# Altium schematic sheet Protect.SchDoc
size A; SheetNumber: 7; SheetTotal: 8
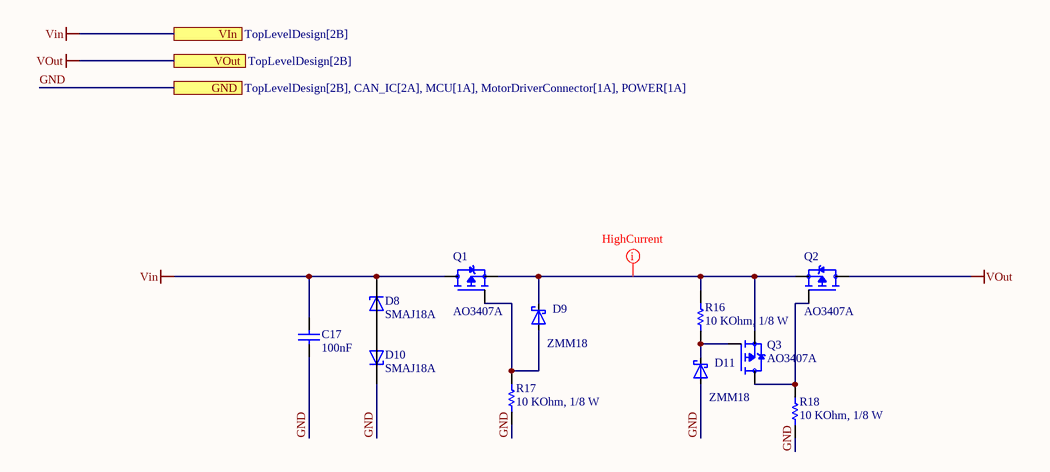
[diagram p0: Protect.SchDoc]

## Parts
C17  value 100nF  [CAP_0805]  (hidden comment: 0108051041050)
D8  SMAJ18A  [DIOM4325X250N]
D9  ZMM18  [SOD-80_MiniMELF_Glass]
D10  SMAJ18A  [DIOM4325X250N]
D11  ZMM18  [SOD-80_MiniMELF_Glass]
Q1  AO3407A  [SOT95P280X125-3N]
Q2  AO3407A  [SOT95P280X125-3N]
Q3  AO3407A  [SOT95P280X125-3N]
R16  value 10 KOhm, 1/8 W  [RESISTOR_0805]  (hidden comment: 0008051031)
R17  value 10 KOhm, 1/8 W  [RESISTOR_0805]  (hidden comment: 0008051031)
R18  value 10 KOhm, 1/8 W  [RESISTOR_0805]  (hidden comment: 0008051031)

## Ports
GND (see TopLevelDesign[2B], CAN_IC[2A], MCU[1A], MotorDriverConnector[1A], POWER[1A]), VIn (see TopLevelDesign[2B]), VOut (see TopLevelDesign[2B])

## Nets
Vin: C17.2 D8.C Q1.3(D) ; port VIn
VOut: Q2.3(D) ; port VOut
GND: C17.1 D10.C D11.A R17.1 R18.1 ; port GND
NetD8_A: D8.A D10.A
NetD9_A: D9.A Q1.1(G) R17.2
NetD9_K: D9.K Q1.2(S) Q2.2(S) Q3.2(S) R16.2
NetD11_K: D11.K Q3.1(G) R16.1
NetQ2_1: Q2.1(G) Q3.3(D) R18.2

## Layout directives
rule Width Constraint [Pref Width = 50mil    Min Width = 50mil    Max Width = 100mil]: NetD9_K

## Library data of the parts
C17 = CMP-001-00259-1: CAP, size 0805, 0.1 nF, 50 VDC; Manufacture Name: TDK; Manufacture SN: CGA4J2X8R1H104K125AD; Voltage Rating DC: 50 VDC; Tolerance: 10%; Pins: 2; Supplier 2 URL: https://www.digikey.com/en/products/detail/tdk-corporation/cga4j2x8r1h104k125ad/3248169; Supplier 1 SN: 810-C2012X8R1H104KEP; Supplier 1 Name: Mouser; Supplier 3 Name: thegioiic; Mounting Technology: SMT; Source: Capacitor_0805_10_percent.SchLib; Supplier 2 SN: 445-8810-2-ND; Supplier 3 SN: OEM; Operating Temperature: -55 to +125degC; Supplier 2 Name: Digi-Key; Component Type: Standard; Design Item ID: 0108051041050; Supplier 1 URL: https://www.mouser.vn/ProductDetail/TDK/CGA4J2X8R1H104K125AD?qs=LcTL%2F5vFEzExqZqv3rh1qQ%3D%3D&utm_source=mouser-refine-download&utm_medium=file&utm_campaign=CGA4J2X8R1H104K125AD&utm_content=TDK; Supplier 3 URL: N/A; Packaging: Tape and Reel; Size: 0805
D8 D10 = CMP-004-00085-1: 400W, 21.1V, 5%, Unidirectional, TVS; MF: Taiwan Semiconductor; SnapEDA_Link: https://www.snapeda.com/parts/SMAJ18A/taiwan/view-part/?ref=snap; Value: *; Component Type: Standard; Case/Package: SMA-2 Taiwan Semiconductor; Check_prices: https://www.snapeda.com/parts/SMAJ18A/taiwan/view-part/?ref=eda; Source: SMAJ18A.SchLib; Design Item ID: SMAJ18A; Pins: 2; MP: SMAJ18A
D9 D11 = CMP-004-00086-2: Value: Shottky-Diode; Reference: D; ki_keywords: Schottky; ki_description: Schottky Diode; Component Type: Standard; Pins: 2; Source: schottky-diode.SchLib; Design Item ID: Schottky-Diode; Datasheet: https://diotec.com/de/produktliste/SBD.html
Q1-Q3 = CMP-123-000000-1: P-Channel 30 V 4.3A (Ta) 1.4W (Ta) Surface Mount SOT-23-3; MF: Alpha &; Design Item ID: AO3407A; Check_prices: https://www.snapeda.com/parts/AO3407A/Alpha/view-part/?ref=eda; SnapEDA_Link: https://www.snapeda.com/parts/AO3407A/Alpha/view-part/?ref=snap; Source: AO3407A.SchLib; Pin Count: 3; Package: SOT-23 Alpha &amp; Omega Semiconductor; Value: *; Component Type: Standard; MP: AO3407A
R16-R18 = CMP-009-00482-1: RES, size 0805, 10 KOhm, 1/8 W; Manufacture  Name: Vishay Dale; Manufacture  SN: CRCW080515K0FKEAC; Rated Power: 1/8 W; Resistance Tolerance: +/-1%; ComponentLink3URL: https://www.digikey.com/en/products/detail/vishay-dale/CRCW080515K0FKEAC/7928558; Supplier 3 SN: N/A; ComponentLink1URL: https://www.vishay.com/docs/28773/crcwce3.pdf; ComponentLink2Description: Supplier 1 URL; Mounting Technology: SMT; Supplier 1 SN: 71-CRCW0805-15K-E3; ComponentLink3Description: Supplier 2 URL; Pins: 2; Size: 0805; ComponentLink1Description: Datasheet link; Supplier 3 URL: N/A; Source: Resistor_0805.SchLib; Supplier 2 URL: https://www.digikey.com/en/products/detail/vishay-dale/CRCW080515K0FKEAC/7928558; ComponentLink4URL: N/A; Supplier 1 URL: https://www.mouser.vn/ProductDetail/Vishay-Dale/CRCW080515K0FKEA?qs=bMjB6bAaLEM4rXT2DoR3BA%3D%3D; Supplier 1 Name: Mouser; Design Item ID: 0008051531; Supplier 2 SN: 541-4136-2-ND; Component Type: Standard; ComponentLink2URL: https://www.mouser.vn/ProductDetail/Vishay-Dale/CRCW080515K0FKEA?qs=bMjB6bAaLEM4rXT2DoR3BA%3D%3D; Supplier 2 Name: Digi-Key; ComponentLink4Description: Supplier 3 URL; Supplier 3 Name: Thegioiic